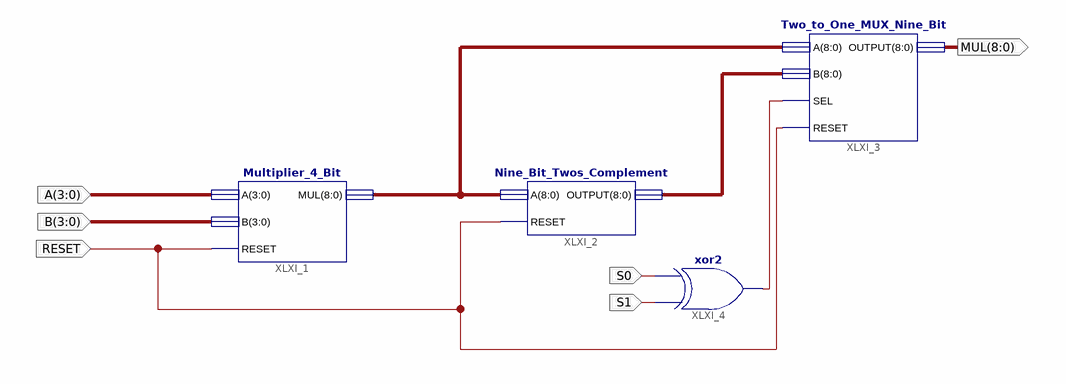
[diagram p0: schematic sheet 1]
// Xilinx ISE schematic Multiplier_Calculator.sch (spartan6) as structural Verilog: 4 symbols, 6 ports
module Multiplier_Calculator (
  input  [3:0] A,
  input  [3:0] B,
  input  S1,
  input  S0,
  input  RESET,
  output [8:0] MUL
);

  wire XLXN_6;
  wire [8:0] XLXN_3, XLXN_4;

  Multiplier_4_Bit XLXI_1 (.A(A), .B(B), .MUL(XLXN_3), .RESET(RESET));
  Nine_Bit_Twos_Complement XLXI_2 (.A(XLXN_3), .OUTPUT(XLXN_4), .RESET(RESET));
  Two_to_One_MUX_Nine_Bit XLXI_3 (.A(XLXN_3), .B(XLXN_4), .OUTPUT(MUL), .RESET(RESET), .SEL(XLXN_6));
  xor XLXI_4 (XLXN_6, S1, S0);
endmodule
